# Altium schematic sheet Relay.SchDoc
size A3; SheetNumber: 1; SheetTotal: 2
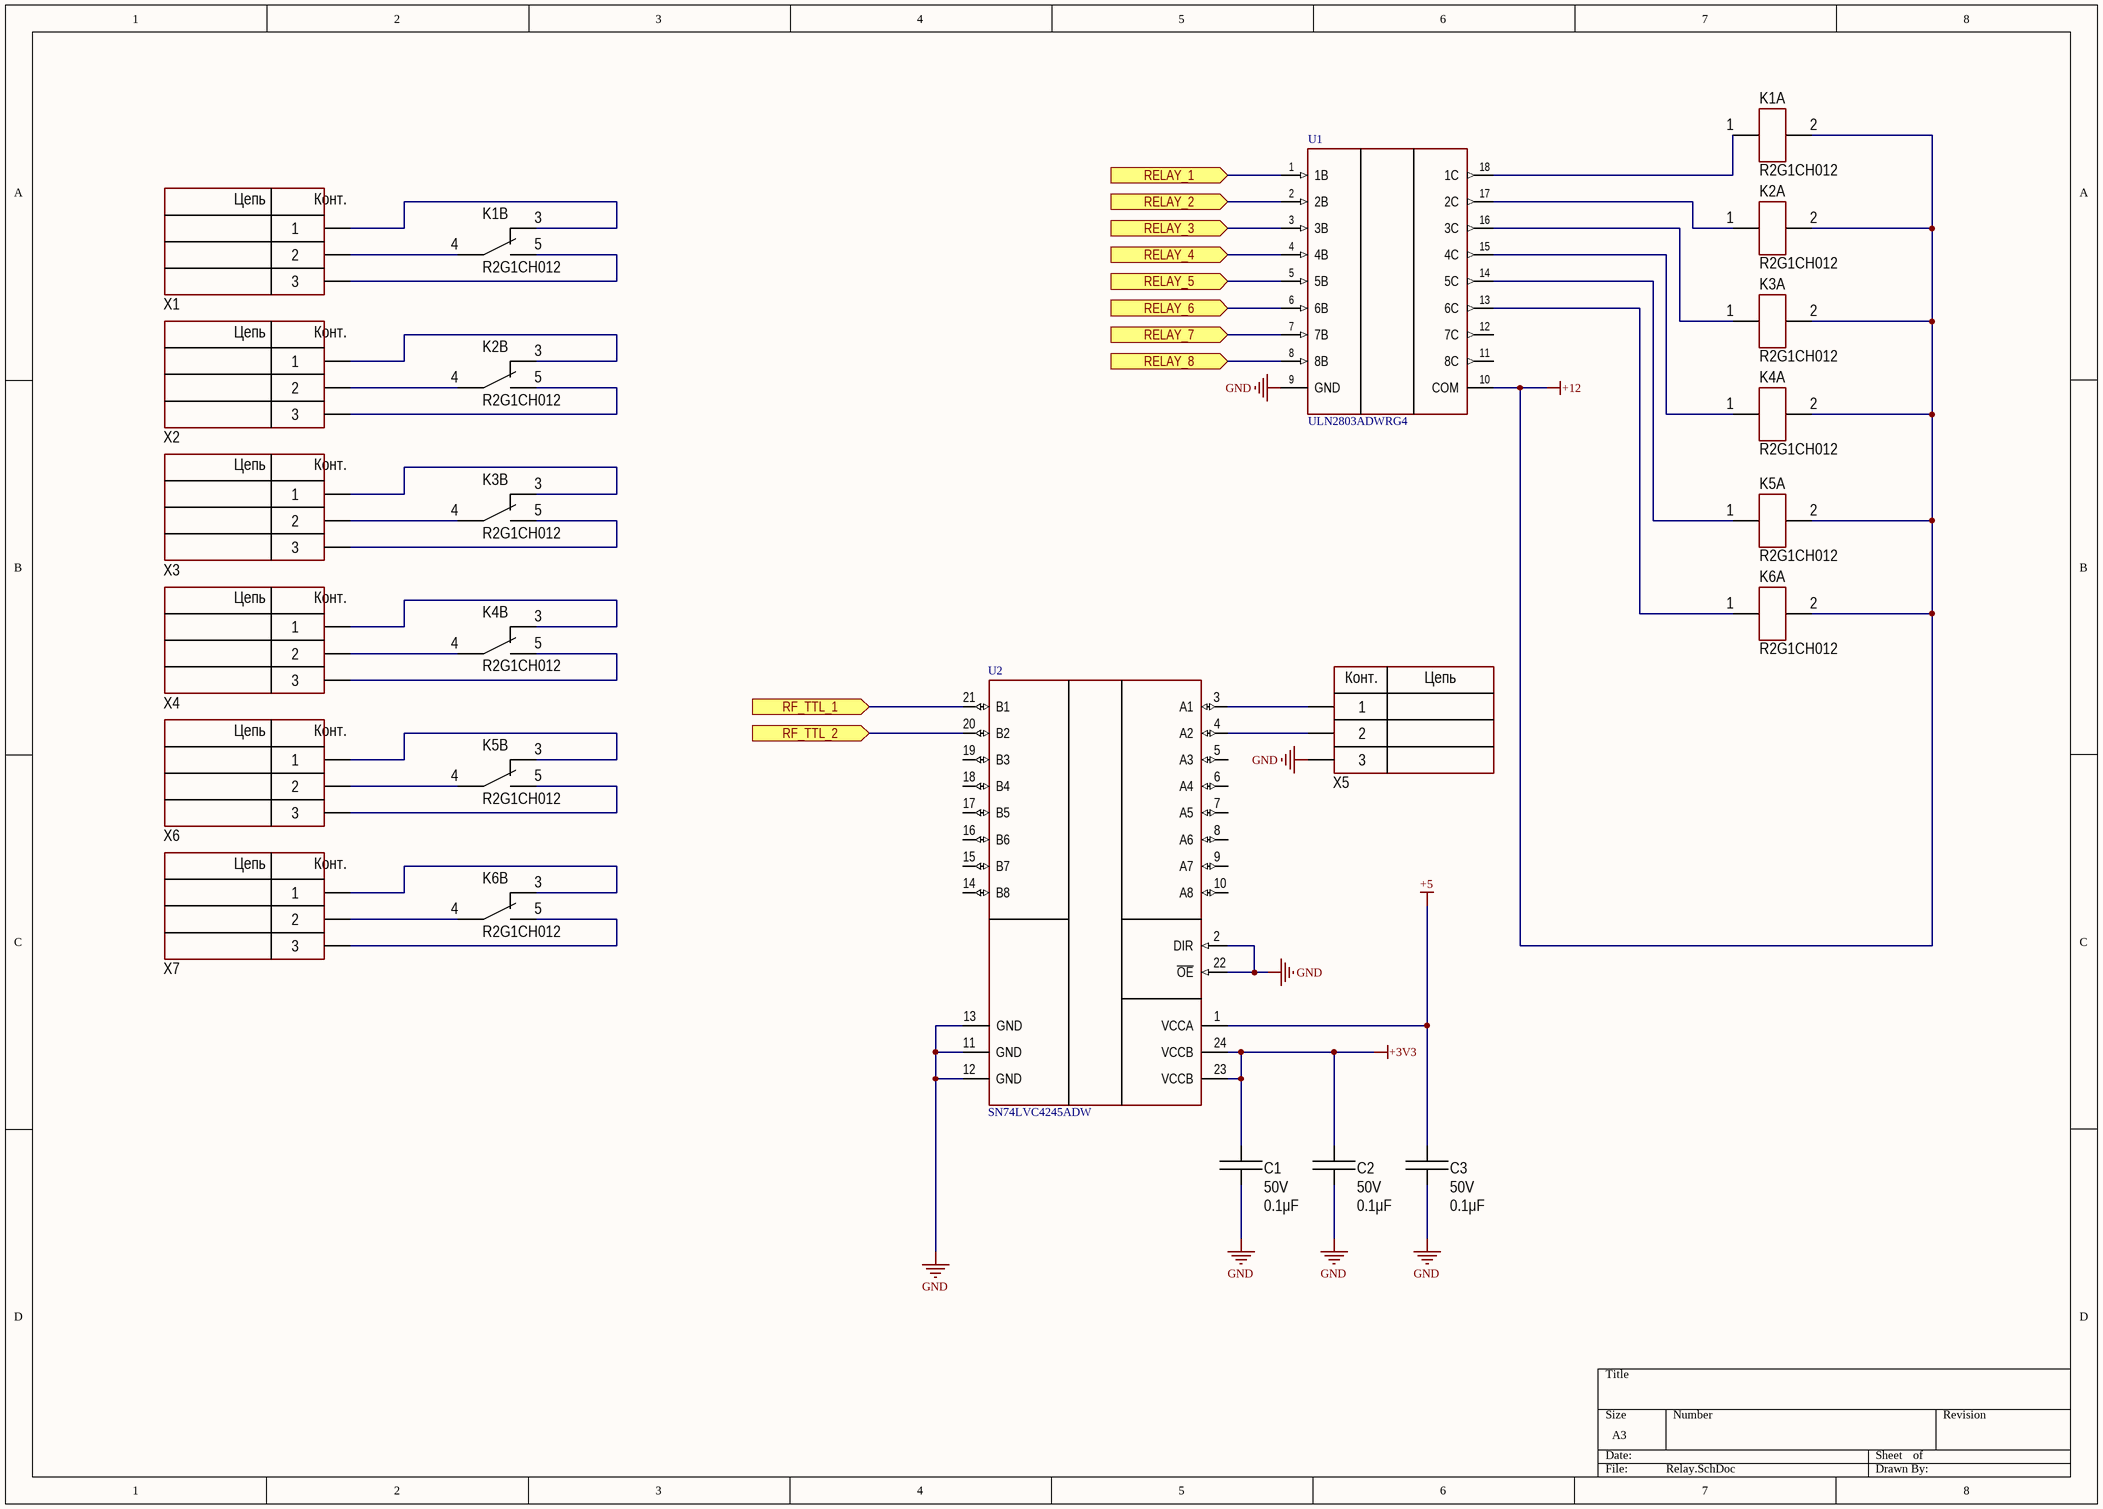
[diagram p0: Relay.SchDoc]

## Parts
C1  value 0.1μF  Voltage: 50V  [CAP: 1206]
C2  value 0.1μF  Voltage: 50V  [CAP: 1206]
C3  value 0.1μF  Voltage: 50V  [CAP: 1206]
K1  (no value)  [R2G1CH012]  (parts A,B of 2)
K2  (no value)  [R2G1CH012]  (parts A,B of 2)
K3  (no value)  [R2G1CH012]  (parts A,B of 2)
K4  (no value)  [R2G1CH012]  (parts A,B of 2)
K5  (no value)  [R2G1CH012]  (parts A,B of 2)
K6  (no value)  [R2G1CH012]  (parts A,B of 2)
U1  ULN2803ADWRG4  [FP-DW0018A-MFG]
U2  SN74LVC4245ADW  [FP-DW0024A-MFG]
X1  (no value)  [2EDGR-5.08-03P]
X2  (no value)  [2EDGR-5.08-03P]
X3  (no value)  [2EDGR-5.08-03P]
X4  (no value)  [2EDGR-5.08-03P]
X5  (no value)  [2EDGR-5.08-03P]
X6  (no value)  [2EDGR-5.08-03P]
X7  (no value)  [2EDGR-5.08-03P]

## Ports
RELAY_1 (in), RELAY_2 (in), RELAY_3 (in), RELAY_4 (in), RELAY_5 (in), RELAY_6 (in), RELAY_7 (in), RELAY_8 (in), RF_TTL_1 (in), RF_TTL_2 (in)

## Nets
+3V3: C1.2 C2.2 U2.23(VCCB) U2.24(VCCB)
+5: C3.2 U2.1(VCCA)
+12: K1.2 K2.2 K3.2 K4.2 K5.2 K6.2 U1.10(COM)
GND: C1.1 C2.1 C3.1 U1.9(GND) U2.2(DIR) U2.11(GND) U2.12(GND) U2.22(~{OE}) X5.3
RELAY_1: U1.1(1B) ; port RELAY_1
RELAY_2: U1.2(2B) ; port RELAY_2
RELAY_3: U1.3(3B) ; port RELAY_3
RELAY_4: U1.4(4B) ; port RELAY_4
RELAY_5: U1.5(5B) ; port RELAY_5
RELAY_6: U1.6(6B) ; port RELAY_6
RELAY_7: U1.7(7B) ; port RELAY_7
RELAY_8: U1.8(8B) ; port RELAY_8
RF_TTL_1: U2.21(B1) ; port RF_TTL_1
RF_TTL_2: U2.20(B2) ; port RF_TTL_2
NetK1_1: K1.1 U1.18(1C)
NetK1_3: K1.3 X1.1
NetK1_4: K1.4 X1.2
NetK1_5: K1.5 X1.3
NetK2_1: K2.1 U1.17(2C)
NetK2_3: K2.3 X2.1
NetK2_4: K2.4 X2.2
NetK2_5: K2.5 X2.3
NetK3_1: K3.1 U1.16(3C)
NetK3_3: K3.3 X3.1
NetK3_4: K3.4 X3.2
NetK3_5: K3.5 X3.3
NetK4_1: K4.1 U1.15(4C)
NetK4_3: K4.3 X4.1
NetK4_4: K4.4 X4.2
NetK4_5: K4.5 X4.3
NetK5_1: K5.1 U1.14(5C)
NetK5_3: K5.3 X6.1
NetK5_4: K5.4 X6.2
NetK5_5: K5.5 X6.3
NetK6_1: K6.1 U1.13(6C)
NetK6_3: K6.3 X7.1
NetK6_4: K6.4 X7.2
NetK6_5: K6.5 X7.3
NetU2_3: U2.3(A1) X5.1
NetU2_4: U2.4(A2) X5.2

Not connected (* = marked no-connect by the designer): U1 11(8C) 12(7C); U2 5(A3) 6(A4) 7(A5) 8(A6) 9(A7) 10(A8) 13(GND) 14(B8) 15(B7) 16(B6) 17(B5) 18(B4) 19(B3)

## Notes on the sheet
- (in symbol 2EDGR-5.08-03P) Цепь; Конт.

## Library data of the parts
C1-C3 = Ceramic_1206: Manufacturer: Yageo; PartNumber: CC1206KRX7R9BB104; ValueManufacturerPartNumber: Ceramic capacitor, 0.1μF, X7R, ±10%, 50V, 1206, -55...+125°C; TypeCapacitor: Ceramic capacitor; Tolerance: ±10%; TypeDielectric: X7R; Package: 1206; HelpURL: https://www.digikey.com/product-detail/en/yageo/CC1206KRX7R9BB104/311-1179-1-ND/303089; Temperature: -55...+125°C
K1-K6 = R2G1CH012: Manufacturer: Omron; ValueManufacturerPartNumber: Electromechanics relay, 3VDC, 125VAC, 2A, 2NO+2NC, -40...+85°C; TypeRelay: Electromechanics relay; VoltageMax: 125VAC; VoltageControlCoil: 3VDC; MaxCurrent: 2A; Package: 2NO+2NC; HelpURL: https://www.digikey.com/product-detail/en/omron-electronics-inc-emc-div/G5V-2-DC3/Z2185-ND/369042; Temperature: -40...+85°C; PartNumber: R2G1CH012
U1 = CMP-04912-000023-1: TRANS 8NPN DARL 50V 0.5A 18SO; Manufacturer: Texas Instruments; Number Of Drivers: 8; Max Junction Temp: +150°C; Standoff Height: 0.1mm; Turn On Delay Time: 20ns; Nominal Supply Current: 0.93mA; Turn Off Delay Time: 130ns; Output Current: 500mA; Manufacturer Part Number: ULN2803ADWRG4; Mouser Description: Darlington Transistors TRANSISTOR ARRAYS; Temperature Range High: +85°C; Ipc Land Pattern Name: SOIC127P1030X265-18; RoHS: TRUE; ComponentLink2URL: http://www.ti.com/lit/ds/symlink/uln2803a.pdf; Device Class L2: Power Management ICs; Output Voltage: 50V; Digikey Description: TRANS 8NPN DARL 50V 0.5A 18SO; Package: DW0018A; Device Class L3: Gate Drivers; Octopart: https://octopart.com/uln2803adwrg4-texas+instruments-2343640; ComponentLink2Description: Datasheet; Ambient Temperature Range High: +85°C; Lead Free: Yes; Device Class L1: Integrated Circuits (ICs); Height: 2.65mm; Category: IC; Automotive: No; Temperature: -40°C to +85°C; Temperature Range Low: -40°C; Ambient Temperature Range Low: -40°C; Number Of Outputs: 8
U2 = CMP-04899-000091-1: IC TRNSLTR BIDIRECTIONAL 24SOIC; Number of Bits: 8; Low Level Output Current: 24mA; Output Type: Voltage; Propagation Delay: 9.8ns; Min Supply Voltage: 4.5V; Number of Elements: 1; Turn-On Delay Time: 6.7ns; Max Supply Current: 80uA; Max Supply Voltage: 5.5V; Polarity: Non-Inverting; Logic Function: Translator; Operating Supply Voltage: 5V; High Level Output Current: -24mA; Case/Package: SOIC; Height: 2.35mm; Width: 7.52mm; Number of Pins: 24; Weight: 0.022025oz; Lead Free: Lead Free; Packaging: Rail/Tube; Number of Channels: 8; Series: 74LVC; REACH SVHC: No SVHC; RoHS Compliant: Yes; Mount: Surface Mount; Length: 15.4mm; Package Quantity: 25; Radiation Hardening: No; Contact Plating: Gold; Quiescent Current: 80uA; Max Operating Temperature: 85°C; Direction: Bidirectional; Number of Outputs: 8; Technology: CMOS; Min Operating Temperature: -40°C; Number of Circuits: 8
X1-X7 = 2EDGR-5.08-03P: Manufacturer: Connfly; ValueManufacturerPartNumber: Connector, 6pin, 2.54mm, 500VAC, 3A; PartNumber: PBS-6; TypeConnector: Connector; VoltageMax: 500VAC; Pitch: 2.54mm; CurrentMax: 3A; Multichannel: 6pin; CommentText: "Разъем"; HelpURL: https://www.chipdip.ru/product/pbs-6